# Altium schematic sheet IC - Power - DC-DC.SchDoc
size A4; SheetNumber: 33; SheetTotal: 41
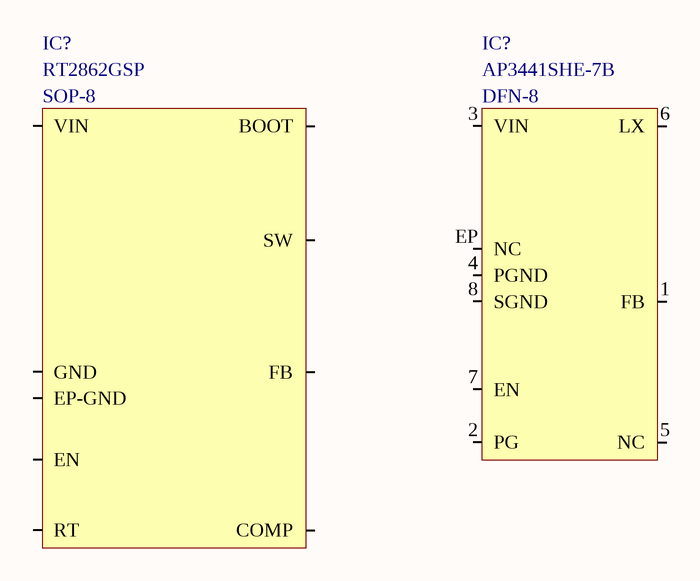
[diagram p0: IC - Power - DC-DC.SchDoc]

## Parts
(Parts that share a designator on the sheet are numbered #1, #2 ... from top to bottom, then left to right.)
IC?#1  Manufacturer Part Number: RT2862GSP  Package: SOP-8  [Richtek, RT2862xSP, SOP-8]  (hidden comment: Richtek, RT2862xSP)
IC?#2  Manufacturer Part Number: AP3441SHE-7B  Package: DFN-8  [DFN-8, 2mm x 2mm, 0.5mm]  (hidden comment: Diodes, AP3441)

## Nets

Not connected (* = marked no-connect by the designer): IC?#1 1-SW(SW) 2-BOOT(BOOT) 3-EN(EN) 4-GND(GND) 5-FB(FB) 6-COMP(COMP) 7-RT(RT) 8-VIN(VIN) EP-GND; IC?#2 1(FB) 2(PG) 3(VIN) 4(PGND) 5(NC) 6(LX) 7(EN) 8(SGND) EP(NC)

## Library data of the parts
IC?#1 = Richtek, RT2862xSP: IC, Power, Buck, SOP-8; ComponentLink1Description: Datasheet; ComponentLink1URL: E:\Altium\Datasheets\IC - Power - DC-DC\Richtek, RT2862.pdf; ComponentLink2Description: Supplier Link; ComponentLink2URL: https://www.digikey.com/en/products/detail/richtek-usa-inc/RT2862GSP/5880463; Supplier: Digikey; Supplier Part Number: 1028-1373-1-ND; Manufacturer: Richtek; Operating Temperature, Min: -40℃; Operating Temperature, Max: +85℃; Quantity, Min: 1; Quantity, Max: 5000; Price, Min: 1.93; Supplier Currency: $; Price, Max: 0.85214; Supplier Link: https://www.digikey.com/en/products/detail/richtek-usa-inc/RT2862GSP/5880463; Component Type: Power; Component Category: IC
IC?#2 = Diodes, AP3441: IC, Power, Buck, DFN-8, 2x2; Manufacturer: Richtek; ComponentLink1Description: Datasheet; ComponentLink1URL: E:\Altium\Datasheets\IC - Power - DC-DC\Diodes, AP3441.pdf; ComponentLink2Description: Supplier Link; ComponentLink2URL: https://www.digikey.com/en/products/detail/diodes-incorporated/AP3441SHE-7B/9765636; Supplier: Digikey; Supplier Part Number: AP3441SHE-7BDICT-ND; Operating Temperature, Min: -40℃; Operating Temperature, Max: +85℃; Quantity, Min: 1; Quantity, Max: 30000; Price, Min: 0.54; Supplier Currency: $; Price, Max: 0.13275; Supplier Link: https://www.digikey.com/en/products/detail/diodes-incorporated/AP3441SHE-7B/9765636; Component Type: Power; Component Category: IC